# Altium project 电调主板.PrjPcb
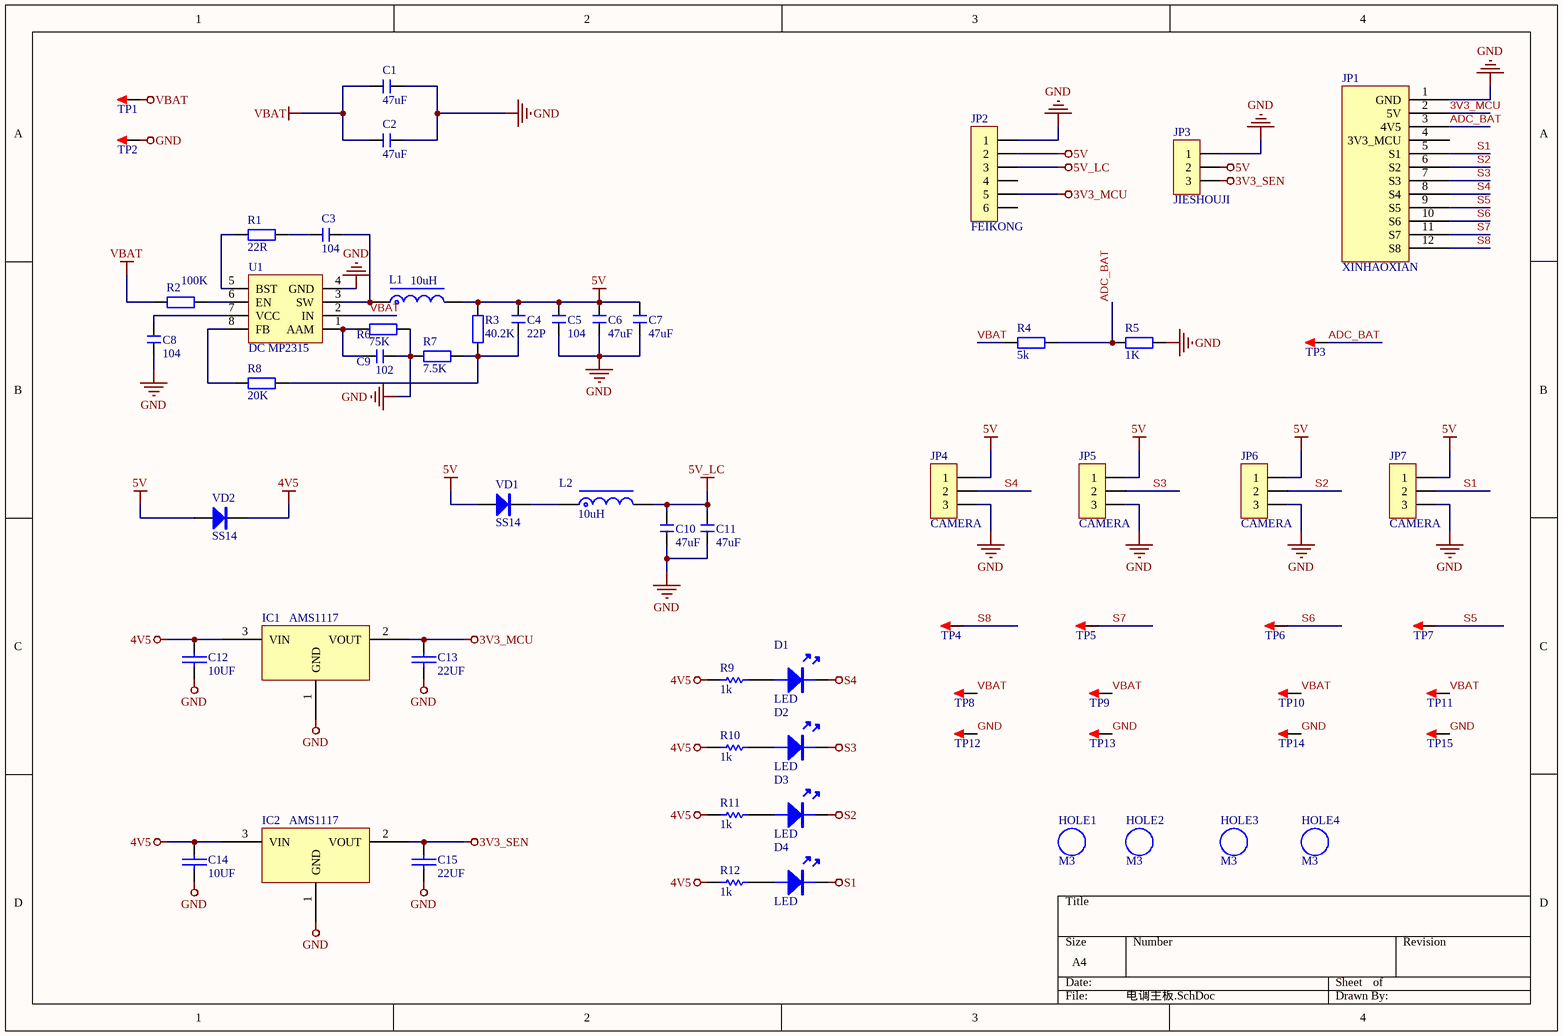
[diagram p0: 电调主板.SchDoc]
1 sheet, 64 parts. Net scope: global (net labels, ports and power ports of the same name join across sheets).
Board file: 电调主板.PcbDoc

## Sheet 电调主板.SchDoc
size A4

### Parts
C1  47uF  [0603C]
C2  47uF  [0603C]
C3  104  [0603C]
C4  22P  [0603C]
C5  104  [0603C]
C6  47uF  [0603C]
C7  47uF  [0603C]
C8  104  [0603C]
C9  102  [0603C]
C10  47uF  [0603C]
C11  47uF  [0603C]
C12  10UF  [0603C]
C13  22UF  [0603C]
C14  10UF  [0603C]
C15  22UF  [0603C]
D1  LED  [LED-0603G]
D2  LED  [LED-0603G]
D3  LED  [LED-0603G]
D4  LED  [LED-0603G]
HOLE1  M3  [M3 5.4MM]
HOLE2  M3  [M3 5.4MM]
HOLE3  M3  [M3 5.4MM]
HOLE4  M3  [M3 5.4MM]
IC1  AMS1117  [AMS1117]
IC2  AMS1117  [AMS1117]
JP1  XINHAOXIAN  [Headr14]
JP2  FEIKONG  [SH1.0 S-W-6P]
JP3  JIESHOUJI  [MX 1.25-WS-3P]
JP4  CAMERA  [MX 1.25-WS-3P]
JP5  CAMERA  [MX 1.25-WS-3P]
JP6  CAMERA  [MX 1.25-WS-3P]
JP7  CAMERA  [MX 1.25-WS-3P]
L1  10uH  [L-SMD-0420]
L2  10uH  [NR3015]
R1  22R  [0805R]
R2  100K  [0805R]
R3  40.2K  [0805R]
R4  5k  [0805R]
R5  1K  [0805R]
R6  75K  [0805R]
R7  7.5K  [0805R]
R8  20K  [0805R]
R9  1k  [0805R]
R10  1k  [0805R]
R11  1k  [0805R]
R12  1k  [0805R]
TP1  TEST  [TEST PAD 1.8]  (value not drawn)
TP2  TEST  [TEST PAD 1.8]  (value not drawn)
TP3  TEST  [TEST PAD 1.8]  (value not drawn)
TP4  TEST  [TEST PAD 1.8]  (value not drawn)
TP5  TEST  [TEST PAD 1.8]  (value not drawn)
TP6  TEST  [TEST PAD 1.8]  (value not drawn)
TP7  TEST  [TEST PAD 1.8]  (value not drawn)
TP8  TEST  [TEST PAD 1.8]  (value not drawn)
TP9  TEST  [TEST PAD 1.8]  (value not drawn)
TP10  TEST  [TEST PAD 1.8]  (value not drawn)
TP11  TEST  [TEST PAD 1.8]  (value not drawn)
TP12  TEST  [TEST PAD 1.8]  (value not drawn)
TP13  TEST  [TEST PAD 1.8]  (value not drawn)
TP14  TEST  [TEST PAD 1.8]  (value not drawn)
TP15  TEST  [TEST PAD 1.8]  (value not drawn)
U1  DC MP2315  [SOT23-8L]
VD1  SS14  [SOD-123]
VD2  SS14  [SOD-123]

### Nets
3V3_MCU: C13.2 IC1.2(VOUT) JP1.2(5V) JP2.5
3V3_SEN: C15.2 IC2.2(VOUT) JP3.3
4V5: C12.2 C14.2 IC1.3(VIN) IC2.3(VIN) R9.1 R10.1 R11.1 R12.1 VD2.2(K)
5V: C4.1 C5.1 C6.1 C7.1 JP2.2 JP3.2 JP4.1 JP5.1 JP6.1 JP7.1 L1.2 R3.2 VD1.1(A) VD2.1(A)
5V_LC: C10.2 C11.2 JP2.3 L2.2
GND: C1.1 C2.1 C5.2 C6.2 C7.2 C8.1 C9.1 C10.1 C11.1 C12.1 C13.1 C14.1 C15.1 IC1.1(GND) IC2.1(GND) JP1.1(GND) JP2.1 JP3.1 JP4.3 JP5.3 JP6.3 JP7.3 R5.1 R6.2 R7.1 TP2.1 TP12.1 TP13.1 TP14.1 TP15.1 U1.4(GND)
S1: D4.K JP1.5(S1) JP7.2
S2: D3.K JP1.6(S2) JP6.2
S3: D2.K JP1.7(S3) JP5.2
S4: D1.K JP1.8(S4) JP4.2
VBAT: C1.2 C2.2 R2.1 R4.2 TP1.1 TP8.1 TP9.1 TP10.1 TP11.1 U1.2(IN)
ADC_BAT: JP1.3(4V5) R4.1 R5.2 TP3.1
S5: JP1.9(S5) TP7.1
S6: JP1.10(S6) TP6.1
S7: JP1.11(S7) TP5.1
S8: JP1.12(S8) TP4.1
NetC3_1: C3.1 L1.1 U1.3(SW)
NetC3_2: C3.2 R1.2
NetC4_2: C4.2 R3.1 R7.2 R8.2
NetC8_2: C8.2 U1.7(VCC)
NetC9_2: C9.2 R6.1 U1.1(AAM)
NetD1_A: D1.A R9.2
NetD2_A: D2.A R10.2
NetD3_A: D3.A R11.2
NetD4_A: D4.A R12.2
NetL2_1: L2.1 VD1.2(K)
NetR1_1: R1.1 U1.5(BST)
NetR2_2: R2.2 U1.6(EN)
NetR8_1: R8.1 U1.8(FB)

Not connected (* = marked no-connect by the designer): JP1 4(3V3_MCU); JP2 4 6

### Library data of the parts
C1-C11 = C: 无极性贴片电容; 版权归属: 源创客; BOM名称: 无极性贴片电容; 学习资源: www.ooocke.com
C12-C15 = CAP: 无极性电容
HOLE1-HOLE4 = M3: 铜柱孔; 版权归属: 源创客; BOM名称: 铜柱孔; 学习资源: www.ooocke.com
IC1 IC2 = AMS1117: 3V3降压芯片
JP1 = Header14: 14PIN接插件
JP2 = Header 6: 6P接插件; 版权归属: 源创客; BOM名称: 6P接插件; 学习资源: www.ooocke.com
JP3-JP7 = Header 3: 3P接插件; 版权归属: 源创客; BOM名称: 3P接插件; 学习资源: www.ooocke.com
L1 = L-CDRH: 功率屏蔽电感; 版权归属: 源创客; BOM名称: 功率屏蔽电感; 学习资源: www.ooocke.com
L2 = L-NR: NR功率电感; 版权归属: 源创客; BOM名称: NR功率电感; 学习资源: www.ooocke.com
R1-R8 = R: 贴片电阻; 版权归属: 源创客; BOM名称: 贴片电阻; 学习资源: www.ooocke.com
R9-R12 = RES
TP1-TP15 = TEST: 测试点; 版权归属: 源创客; BOM名称: 测试点; 学习资源: www.ooocke.com
U1 = DC MP2315: DC降压芯片
VD1 VD2 = SS14: 肖特基二极管; 版权归属: 源创客; 属性: 40V/1A; BOM名称: 肖特基二极管; 学习资源: www.ooocke.com